# EAGLE design CVSummer (EAGLE 7.7.0)
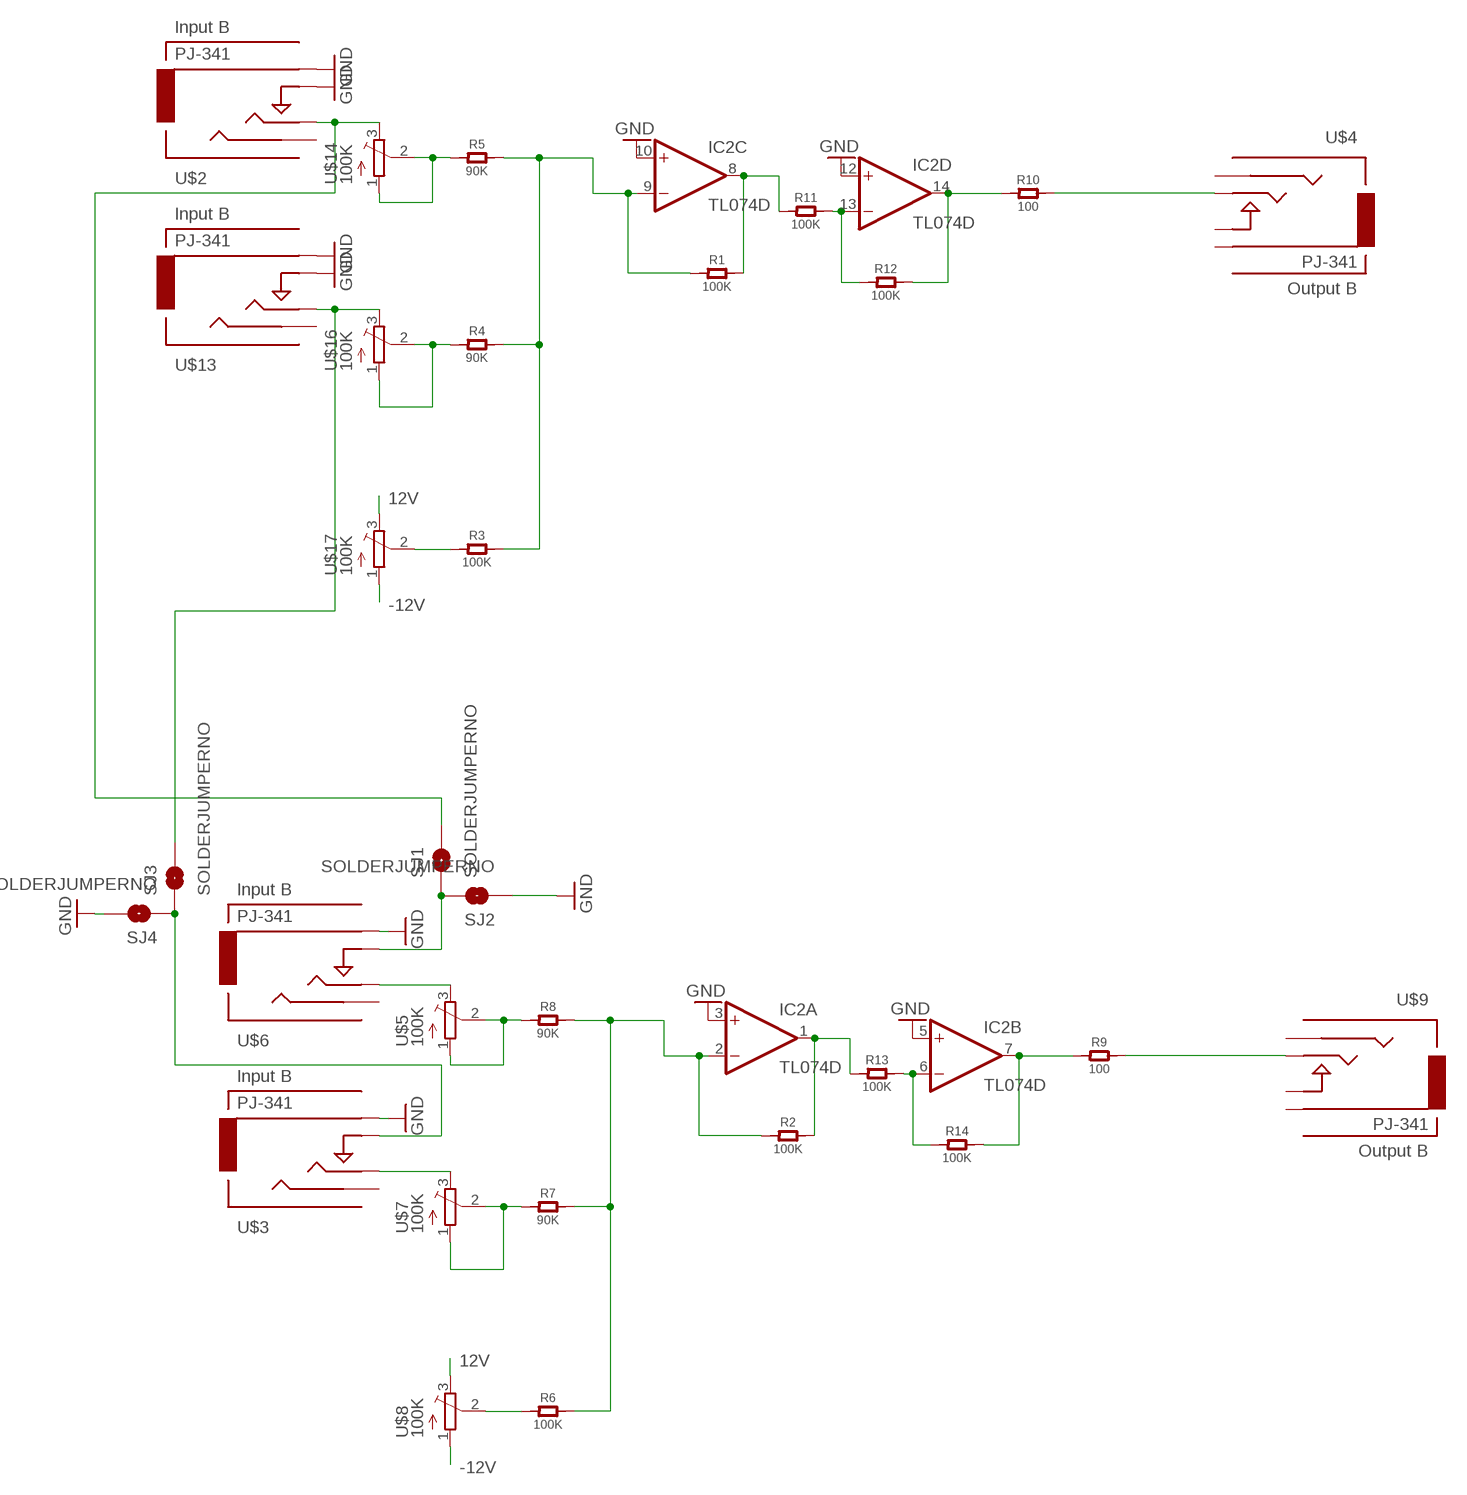
[diagram p0: schematic, sheet 1, part 1 of 2]
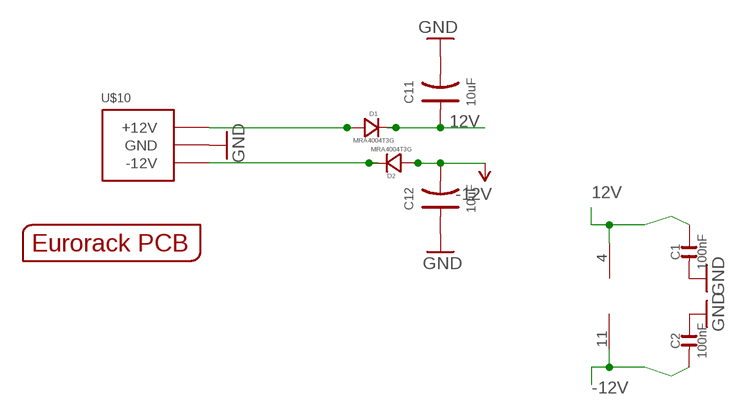
[diagram p1: schematic, sheet 1, part 2 of 2]

## Parts
C1  100nF  C-0603  [C0603]
C2  100nF  C-0603  [C0603]
C11  10uF  C-POLAR-A  [AVX-A]
C12  10uF  C-POLAR-A  [AVX-A]
D1  MRA4004T3G  D-SMA  [DO-214AC]
D2  MRA4004T3G  D-SMA  [DO-214AC]
IC2  TL074D  [SO14]
R1  100K  R  [C0805]
R2  100K  R  [C0805]
R3  100K  R  [C0805]
R4  90K  R  [C0805]
R5  90K  R  [C0805]
R6  100K  R  [C0805]
R7  90K  R  [C0805]
R8  90K  R  [C0805]
R9  100  R  [C0805]
R10  100  R  [C0805]
R11  100K  R  [C0805]
R12  100K  R  [C0805]
R13  100K  R  [C0805]
R14  100K  R  [C0805]
SJ1  SOLDERJUMPERNO  [SJ_2S-NO]
SJ2  SOLDERJUMPERNO  [SJ_2S-NO]
SJ3  SOLDERJUMPERNO  [SJ_2S-NO]
SJ4  SOLDERJUMPERNO  [SJ_2S-NO]
U$1  EURORACK_PCB4HP  [EURORACK4HPPCB]
U$2  PJ-341  AUDIO-JACKINPUT  [3.5MM-JACK-SWITCH-13MM-INPUT]
U$3  PJ-341  AUDIO-JACKINPUT  [3.5MM-JACK-SWITCH-13MM-INPUT]
U$4  PJ-341  AUDIO-JACKOUTPUT  [3.5MM-JACK-SWITCH-13MM-OUTPUT]
U$5  100K  TRIMPOTTC33X  [TC33X]
U$6  PJ-341  AUDIO-JACKINPUT  [3.5MM-JACK-SWITCH-13MM-INPUT]
U$7  100K  TRIMPOTTC33X  [TC33X]
U$8  100K  TRIMPOTTC33X  [TC33X]
U$9  PJ-341  AUDIO-JACKOUTPUT  [3.5MM-JACK-SWITCH-13MM-OUTPUT]
U$10  POWER_SIMPLE10  [POWER_10]
U$13  PJ-341  AUDIO-JACKINPUT  [3.5MM-JACK-SWITCH-13MM-INPUT]
U$14  100K  TRIMPOTTC33X  [TC33X]
U$16  100K  TRIMPOTTC33X  [TC33X]
U$17  100K  TRIMPOTTC33X  [TC33X]

## Nets
12V: C1.2 C11.+ D1.2(-) IC2.4(P:V+) U$8.3(E) U$17.3(E)
-12V: C2.1 C12.- D2.1(+) IC2.11(P:V-) U$8.1(A) U$17.1(A)
GND: C1.1 C2.2 C11.- C12.+ IC2.3(A:+IN) IC2.5(B:+IN) IC2.10(C:+IN) IC2.12(D:+IN) SJ2.1 SJ4.2 U$2.RING@3(RING) U$2.SWITCH@3(SWITCH) U$3.RING@3(RING) U$6.RING@3(RING) U$10.3(GND) U$10.4(GND) U$10.5(GND) U$10.6(GND) U$10.7(GND) U$10.8(GND) U$13.RING@3(RING) U$13.SWITCH@3(SWITCH)
N$1: SJ1.1 SJ2.2 U$6.SWITCH@3(SWITCH)
N$2: IC2.14(D:OUT) R10.1 R12.2
N$3: R5.1 U$14.1(A) U$14.2(S)
N$4: U$5.3(E) U$6.TIP@3(TIP)
N$5: IC2.7(B:OUT) R9.1 R14.2
N$6: R3.1 U$17.2(S)
N$7: IC2.8(C:OUT) R1.2 R11.1
N$8: IC2.13(D:-IN) R11.2 R12.1
N$9: R6.1 U$8.2(S)
N$10: R4.1 U$16.1(A) U$16.2(S)
N$11: U$3.TIP@3(TIP) U$7.3(E)
N$12: SJ3.2 U$13.TIP@3(TIP) U$16.3(E)
N$13: IC2.2(A:-IN) R2.1 R6.2 R7.2 R8.2
N$14: IC2.9(C:-IN) R1.1 R3.2 R4.2 R5.2
N$15: R9.2 U$9.TIP@3(TIP)
N$16: R8.1 U$5.1(A) U$5.2(S)
N$17: R7.1 U$7.1(A) U$7.2(S)
N$18: IC2.1(A:OUT) R2.2 R13.1
N$19: IC2.6(B:-IN) R13.2 R14.1
N$20: SJ1.2 U$2.TIP@3(TIP) U$14.3(E)
N$21: SJ3.1 SJ4.1 U$3.SWITCH@3(SWITCH)
N$22: R10.2 U$4.TIP@3(TIP)
N$28 [heavypower]: D1.1(+) U$10.9(+12V) U$10.10(+12V)
N$64 [heavypower]: D2.2(-) U$10.1(-12V) U$10.2(-12V)
Unconnected: U$2.SECOND@3(SECOND) U$3.SECOND@3(SECOND) U$4.RING@3(RING) U$4.SECOND@3(SECOND) U$4.SWITCH@3(SWITCH) U$6.SECOND@3(SECOND) U$9.RING@3(RING) U$9.SECOND@3(SECOND) U$9.SWITCH@3(SWITCH) U$13.SECOND@3(SECOND)

## Library data of the parts
C1 C2 = OPL:C*
C11 C12 = OPL:C-POLAR*
D1 D2 = OPL:D*: DIODE; MF: VISHAY; MPN: US1G-E3/5AT; OC_FARNELL: 9551824
IC2 = EurorackModularParts:TL074: OP AMP
R1-R14 = OPL:R*
SJ1-SJ4 = SparkFun-Passives:SOLDERJUMPER: Solder Jumper Standard SMD solder jumper. Used to automate production. Two varients : Normally Open and Normally Closed are the same, but have different paste layers. NC will have a large amount of paste and should jumper during reflow.
U$1 = EurorackModularParts:EURORACK_PCB
U$2 U$3 U$6 U$13 = EurorackModularParts:AUDIO-JACK: Switching Mono 3.5mm Audio Jack from Erthenvar.; DESC: Input B; MPN: PJ-341
U$4 U$9 = EurorackModularParts:AUDIO-JACK: Switching Mono 3.5mm Audio Jack from Erthenvar.; DESC: Output B; MPN: PJ-341
U$5 U$7 U$8 U$14 U$16 U$17 = adafruit:TRIMPOT: SMT trimmer potentiometer part number TC33X http://www.ladyada.net/library/eagle
U$10 = EurorackModularParts:POWER_SIMPLE

## Net classes
0 default: width 0.305 mm
1 heavypower: width 0.381 mm

## Board
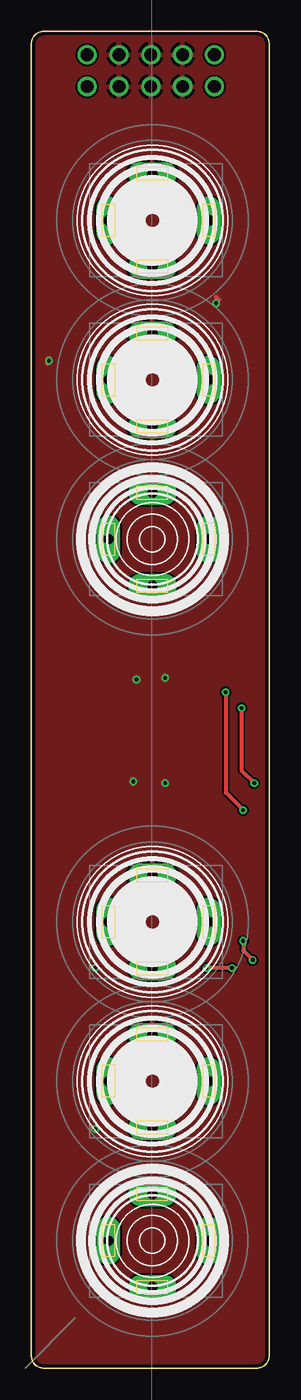
[diagram p2: board, top side]
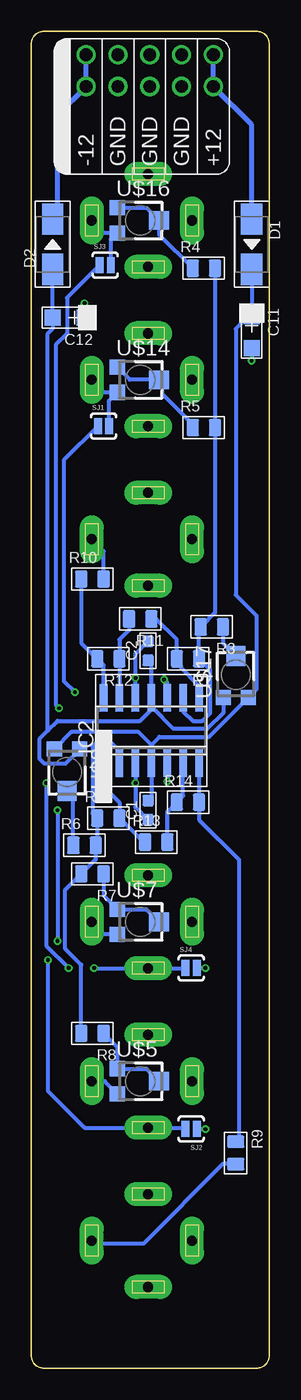
[diagram p3: board, bottom side, seen from below]

Size 18.98 x 106.5 mm. Coordinates in mm from the lower left corner, seen from the top.
Copper layers (1*16): Top 0.035mm / dielectric 1.5mm / Bottom 0.035mm
Design rules "ITEADstudio_DRC": minimum track width 6mil, minimum drill 12mil, track to track 6mil, track to pad 6mil, pad to pad 6mil, via to via 6mil, smd to smd 0mil, copper to edge 10mil, drill to drill 10mil, minimum pad ring 10mil, minimum via ring 6mil, stop-mask expansion 2mil, vias tented up to drill 100mil, thermal gap 10mil

### Footprints (pad centres in the part's own frame; a part is rotated, then mirrored left to right if it is on the bottom)
C0603 = smd 0.889 x 0.889: 1 -0.762,0; 2 0.762,0
AVX-A = smd 1.27 x 1.27: + -1.27,0; - 1.27,0
DO-214AC = smd 2.5 x 1.7: 1 -2,0; 2 2,0
SO14 = smd 0.6 x 2.2: 1 -3.81,-2.6; 2 -2.54,-2.6; 3 -1.27,-2.6; 4 0,-2.6; 5 1.27,-2.6; 6 2.54,-2.6; 7 3.81,-2.6; 8 3.81,2.6; 9 2.54,2.6; 10 1.27,2.6; 11 0,2.6; 12 -1.27,2.6; 13 -2.54,2.6; 14 -3.81,2.6
C0805 = smd 1.016 x 1.397: 1 -0.889,0; 2 0.889,0
SJ_2S-NO = smd 0.635 x 1.27: 1 -0.45,0; 2 0.45,0
3.5MM-JACK-SWITCH-13MM-INPUT = drill 0.8 pad 1.93 long: RING@3 -3.7,0; SECOND@3 0,-3.5; SWITCH@3 3.7,0; TIP@3 0,4.5
3.5MM-JACK-SWITCH-13MM-OUTPUT = drill 0.8 pad 1.93 long: RING@3 -3.7,0; SECOND@3 0,-3.5; SWITCH@3 3.7,0; TIP@3 0,4.5
TC33X = smd 1.2 x 1.2: 1 -1,-1.825; 3 1,-1.825 | smd 1.5 x 1.6: 2 0,1.5
POWER_10 = drill 1.016: 1 -5.08,-1.27; 2 -5.08,1.27; 3 -2.54,-1.27; 4 -2.54,1.27; 5 0,-1.27; 6 0,1.27; 7 2.54,-1.27; 8 2.54,1.27; 9 5.08,-1.27; 10 5.08,1.27

### Placement (x,y rotation side)
C1  9.66,44.45 90 bottom
C2  9.66,57.15 90 bottom
C11  1.41,82.55 270 bottom
C12  16.01,83.69 180 bottom
D1  1.41,89.53 270 bottom
D2  17.28,89.53 90 bottom
IC2  9.41,50.8 0 bottom
R1  6.49,56.52 180 bottom
R2  12.84,43.81 0 bottom
R3  4.58,59.05 180 bottom
R4  5.21,87.63 0 bottom
R5  5.21,74.93 0 bottom
R6  14.74,41.66 0 bottom
R7  14.11,39.37 180 bottom
R8  14.11,26.67 180 bottom
R9  2.67,17.14 270 bottom
R10  14.11,62.87 0 bottom
R11  10.29,59.69 180 bottom
R12  12.84,56.52 180 bottom
R13  9.03,41.91 0 bottom
R14  6.49,45.09 0 bottom
SJ1  13.22,75.06 0 bottom
SJ2  6.23,19.05 180 bottom
SJ3  13.09,87.88 0 bottom
SJ4  6.23,31.88 0 bottom
U$1  -0.5,0 0 top
U$2  9.66,78.74 270 top
U$3  9.66,35.56 270 top
U$4  9.66,66.04 270 top
U$5  10.29,22.86 270 bottom
U$6  9.66,22.86 270 top
U$7  10.29,35.56 270 bottom
U$8  16.14,47.5 180 bottom
U$9  9.66,10.16 270 top
U$10  9.53,103.38 0 bottom
U$13  9.66,91.44 270 top
U$14  10.29,78.74 270 bottom
U$16  10.29,91.44 270 bottom
U$17  2.67,55.24 0 bottom

### Tracks (layer width: path | path; a pad name or v marks a point on that pad's centre or on a via)
12V
  Bottom 0.305: C1.2 9.41,45.47 IC2.4 9.41,49.66 | 9.41,49.66 10.42,50.67 15.79,50.67 U$8.3 | 9.41,49.66 8.77,50.29 4.8,50.29 U$17.3 1.02,54.07 1.02,59.94 2.67,61.59 2.67,82.8 1.66,83.82 C11.+ D1.2
-12V
  Bottom 0.305: C2.1 9.41,56.13 IC2.11 9.41,52.7 9.28,52.58 | U$17.1 3.67,52.21 4.96,50.93 7.63,50.93 9.28,52.58 | U$8.1 15.14,49.26 16.26,48.13 17.91,48.13 18.3,48.51 18.3,50.16 17.66,50.8 | 17.66,50.8 16.9,51.56 10.29,51.56 9.28,52.58 | 17.66,50.8 17.66,82.42 17.28,82.8 C12.- D2.1
GND  (via drill 0.3)
  Top 0.305: v8.39,54.86 8.39,54.99 | v1.41,80.26 1.41,80.14 1.28,80.01 | v14.74,84.84 14.99,85.09 14.74,85.34 | v5.09,31.88 4.96,31.88 4.83,32 | v5.09,19.05 4.83,19.05
  Bottom 0.305: C2.2 10.68,56.9 v10.68,54.99 IC2.12 | C1.1 10.68,44.7 v10.68,46.61 IC2.3 | IC2.10 8.14,54.61 v8.39,54.86 | IC2.5 v8.14,46.74 | C11.- v1.41,80.26 | C12.+ v14.74,84.84 | SJ4.2 v5.09,31.88 | SJ2.1 v5.09,19.05
  pour Top: 19.57,106.68 -0.75,106.68 -0.5,0 19.82,0
N$1  (via drill 0.3)
  Top 0.305: v15.5,53.85 15.5,45.85 v16.9,44.45 | v16.9,34.04 16.9,33.27 v17.66,32.51
  Bottom 0.305: SJ2.2 6.79,19.16 U$6.SWITCH@3 14.72,19.16 17.66,22.1 v17.66,32.51 | SJ1.1 16.39,72.33 16.39,54.74 v15.5,53.85 | v16.9,44.45 v16.9,34.04
N$2
  Bottom 0.305: IC2.14 13.22,56.01 R12.2 14.99,57.78 R10.1
N$3
  Bottom 0.305: R5.1 6.1,75.18 8.52,77.6 8.52,78.46 U$14.2 11.12,78.74 U$14.1
N$4
  Bottom 0.305: U$6.TIP@3 13.12,22.86 U$5.3
N$5
  Bottom 0.305: IC2.7 R14.2 5.6,43.69 2.42,40.51 2.42,18.29 R9.1
N$6
  Bottom 0.305: R3.1 3.69,57.76 U$17.2
N$7
  Bottom 0.305: IC2.8 5.6,54.36 7.12,55.88 7.12,56.26 R1.2 7.37,58.04 9.03,59.69 R11.1
N$8
  Bottom 0.305: R11.2 11.18,58.8 11.95,58.04 R12.1 IC2.13
N$9
  Bottom 0.305: R6.1 15.63,45.49 U$8.2
N$10
  Bottom 0.305: U$16.1 9.79,92.44 U$16.2 8.79,90.32 R4.1
N$11
  Bottom 0.305: U$7.3 13.16,34.56 U$3.TIP@3
N$12
  Bottom 0.305: U$13.TIP@3 13.16,90.44 U$16.3 12.64,89.92 SJ3.2
N$13
  Bottom 0.305: IC2.2 11.95,49.15 12.84,50.04 13.6,50.04 14.11,49.53 14.11,44.2 R2.1 13.72,41.78 R6.2 13.85,40.51 R7.2 16.26,38.1 16.26,33.4 14.99,32.13 R8.2
N$14
  Bottom 0.305: IC2.9 6.87,52.32 6.1,51.56 5.34,51.56 4.71,52.2 4.71,55.63 R1.1 5.6,59.05 5.21,59.44 5.21,59.31 R3.2 4.33,60.2 R5.2 R4.2
N$15
  Bottom 0.305: R9.2 3.69,16.26 10.04,9.91 13.91,9.91 U$9.TIP@3
N$16
  Bottom 0.305: U$5.2 9.79,23.86 U$5.1 12.12,25.57 R8.1
N$17
  Bottom 0.305: R7.1 13.22,37.66 U$7.1 9.79,36.56 U$7.2
N$18
  Bottom 0.305: R13.1 10.04,41.91 R2.2 11.95,45.09 13.22,46.35 IC2.1
N$19
  Bottom 0.305: R13.2 8.14,44.32 R14.1 6.87,45.59 IC2.6
N$20
  Bottom 0.305: U$2.TIP@3 13.16,77.74 U$14.3 12.77,77.09 SJ1.2
N$21  (via drill 0.3)
  Top 0.305: v16.77,52.58 16.77,47.62 v17.79,46.61 | v16.01,31.88 v13.98,31.88
  Bottom 0.305: SJ4.1 6.7,31.86 U$3.SWITCH@3 13.96,31.86 v13.98,31.88 | SJ3.1 16.14,85.29 16.14,82.42 17.03,81.53 17.03,52.83 v16.77,52.58 | v17.79,46.61 17.79,33.66 v16.01,31.88
N$22
  Bottom 0.305: R10.2 13.22,65.1 U$4.TIP@3
N$28
  Bottom 0.381: U$10.10 U$10.9 1.41,99.06 D1.1
N$64
  Bottom 0.381: U$10.2 U$10.1 16.87,99.85 16.87,91.95 D2.2